# Altium schematic sheet 04_CONNECTOR_OUT_2.SchDoc
size 420 x 297 mm; SheetNumber: 6; SheetTotal: 29
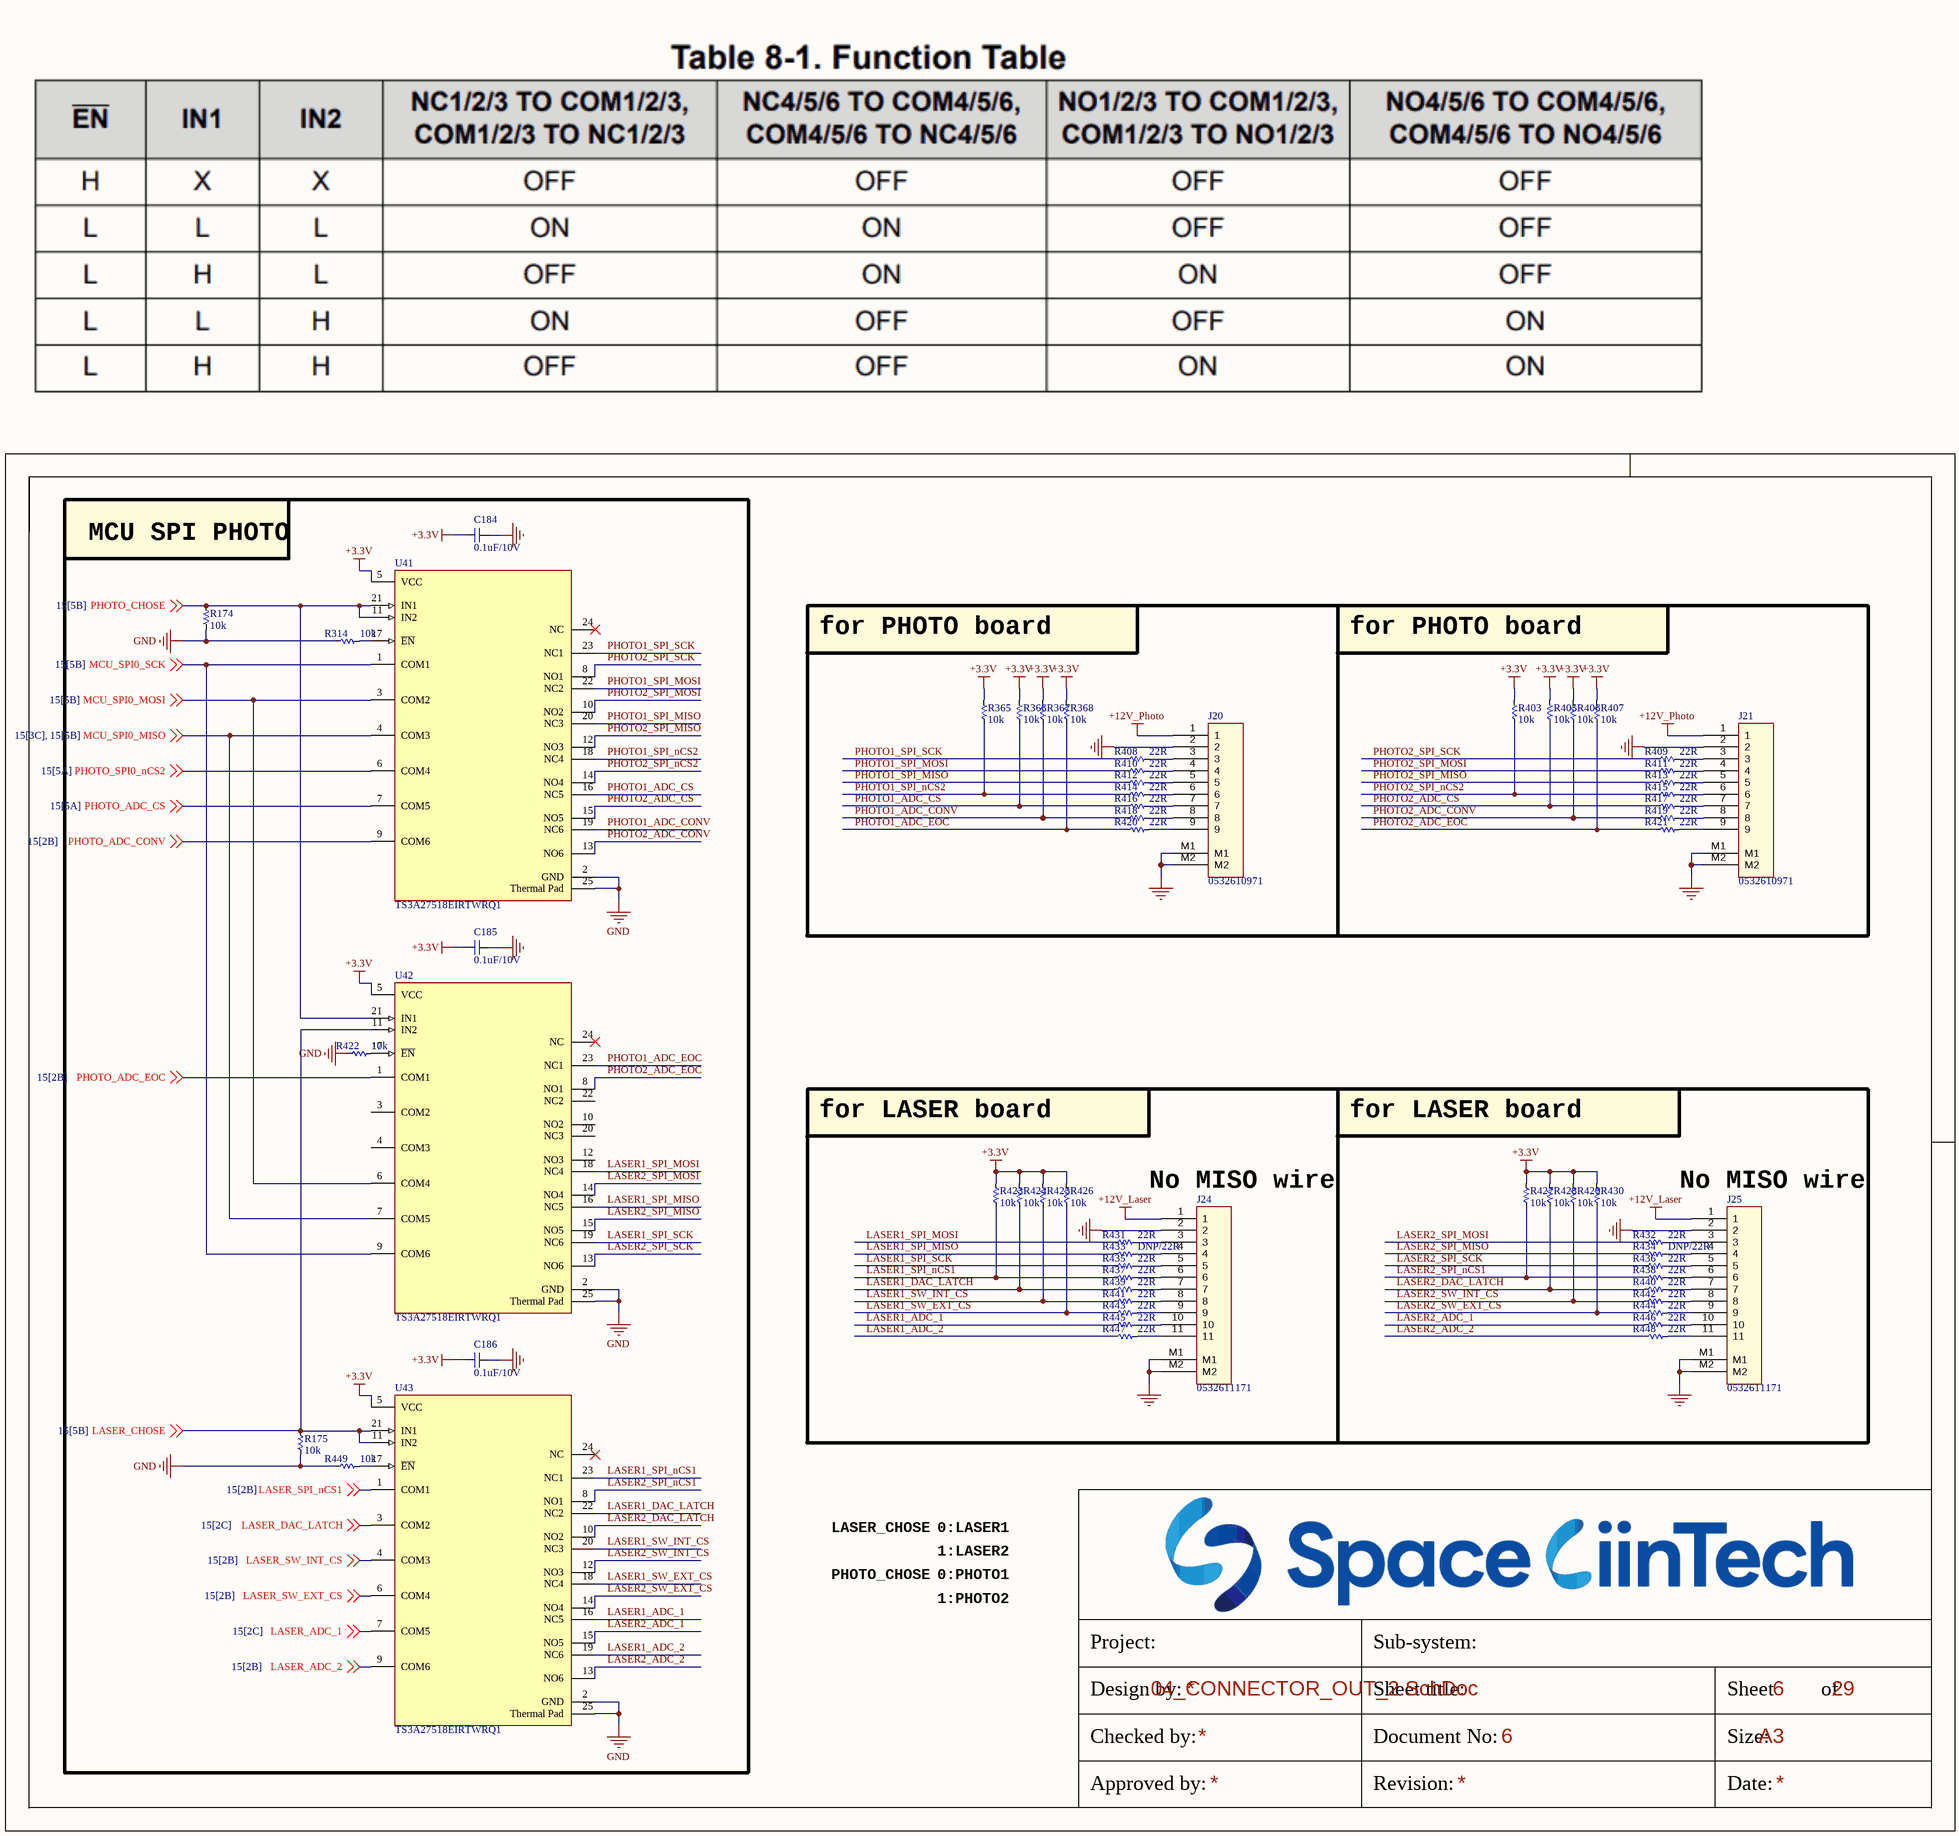
[diagram p0: 04_CONNECTOR_OUT_2.SchDoc]

## Parts
C184  0.1uF/10V  [CAP_C_1005X60]
C185  0.1uF/10V  [CAP_C_1005X60]
C186  0.1uF/10V  [CAP_C_1005X60]
J20  0532610971  [MOLEX_0532610971]
J21  0532610971  [MOLEX_0532610971]
J24  0532611171  [MOLEX_0532611171]
J25  0532611171  [MOLEX_0532611171]
R174  10k  [RES_C_1005X40]
R175  10k  [RES_C_1005X40]
R314  10k  [RES_C_1005X40]
R365  10k  [RES_C_1005X40]
R366  10k  [RES_C_1005X40]
R367  10k  [RES_C_1005X40]
R368  10k  [RES_C_1005X40]
R403  10k  [RES_C_1005X40]
R405  10k  [RES_C_1005X40]
R406  10k  [RES_C_1005X40]
R407  10k  [RES_C_1005X40]
R408  22R  [RES_C_1005X40]
R409  22R  [RES_C_1005X40]
R410  22R  [RES_C_1005X40]
R411  22R  [RES_C_1005X40]
R412  22R  [RES_C_1005X40]
R413  22R  [RES_C_1005X40]
R414  22R  [RES_C_1005X40]
R415  22R  [RES_C_1005X40]
R416  22R  [RES_C_1005X40]
R417  22R  [RES_C_1005X40]
R418  22R  [RES_C_1005X40]
R419  22R  [RES_C_1005X40]
R420  22R  [RES_C_1005X40]
R421  22R  [RES_C_1005X40]
R422  10k  [RES_C_1005X40]
R423  10k  [RES_C_1005X40]
R424  10k  [RES_C_1005X40]
R425  10k  [RES_C_1005X40]
R426  10k  [RES_C_1005X40]
R427  10k  [RES_C_1005X40]
R428  10k  [RES_C_1005X40]
R429  10k  [RES_C_1005X40]
R430  10k  [RES_C_1005X40]
R431  22R  [RES_C_1005X40]
R432  22R  [RES_C_1005X40]
R433  DNP/22R  [RES_C_1005X40]
R434  DNP/22R  [RES_C_1005X40]
R435  22R  [RES_C_1005X40]
R436  22R  [RES_C_1005X40]
R437  22R  [RES_C_1005X40]
R438  22R  [RES_C_1005X40]
R439  22R  [RES_C_1005X40]
R440  22R  [RES_C_1005X40]
R441  22R  [RES_C_1005X40]
R442  22R  [RES_C_1005X40]
R443  22R  [RES_C_1005X40]
R444  22R  [RES_C_1005X40]
R445  22R  [RES_C_1005X40]
R446  22R  [RES_C_1005X40]
R447  22R  [RES_C_1005X40]
R448  22R  [RES_C_1005X40]
R449  10k  [RES_C_1005X40]
U41  TS3A27518EIRTWRQ1  [FP-RTW0024B-IPC_A]
U42  TS3A27518EIRTWRQ1  [FP-RTW0024B-IPC_A]
U43  TS3A27518EIRTWRQ1  [FP-RTW0024B-IPC_A]

## Blocks framed on the sheet
MCU SPI PHOTO: C184-C186 R174 R175 R314 R422 R449 U41-U43
for PHOTO board: J20 R365-R368 R408 R410 R412 R414 R416 R418 R420
for PHOTO board: J21 R403 R405-R407 R409 R411 R413 R415 R417 R419 R421

## Nets
+3.3V: C184.2 C185.2 C186.2 R365.1 R366.1 R367.1 R368.1 R403.1 R405.1 R406.1 R407.1 R423.1 R424.1 R425.1 R426.1 R427.1 R428.1 R429.1 R430.1 U41.5(VCC) U42.5(VCC) U43.5(VCC)
+12V_Laser: J24.1 J25.1
+12V_Photo: J20.1 J21.1
GND: C184.1 C185.1 C186.1 J20.2 J20.M1 J20.M2 J21.2 J21.M1 J21.M2 J24.2 J24.M1 J24.M2 J25.2 J25.M1 J25.M2 R174.1 R175.1 R314.1 R422.1 R449.1 U41.2(GND) U41.25(Thermal_Pad) U42.2(GND) U42.25(Thermal_Pad) U43.2(GND) U43.25(Thermal_Pad)
LASER1_ADC_1: R445.1 U43.16(NC5)
LASER1_ADC_2: R447.1 U43.19(NC6)
LASER1_DAC_LATCH: R424.2 R439.1 U43.22(NC2)
LASER1_SPI_MISO: R433.1 U42.16(NC5)
LASER1_SPI_MOSI: R431.1 U42.18(NC4)
LASER1_SPI_nCS1: R423.2 R437.1 U43.23(NC1)
LASER1_SPI_SCK: R435.1 U42.19(NC6)
LASER1_SW_EXT_CS: R426.2 R443.1 U43.18(NC4)
LASER1_SW_INT_CS: R425.2 R441.1 U43.20(NC3)
LASER2_ADC_1: R446.1 U43.15(NO5)
LASER2_ADC_2: R448.1 U43.13(NO6)
LASER2_DAC_LATCH: R428.2 R440.1 U43.10(NO2)
LASER2_SPI_MISO: R434.1 U42.15(NO5)
LASER2_SPI_MOSI: R432.1 U42.14(NO4)
LASER2_SPI_nCS1: R427.2 R438.1 U43.8(NO1)
LASER2_SPI_SCK: R436.1 U42.13(NO6)
LASER2_SW_EXT_CS: R430.2 R444.1 U43.14(NO4)
LASER2_SW_INT_CS: R429.2 R442.1 U43.12(NO3)
LASER_ADC_1: U43.7(COM5) ; off-sheet LASER_ADC_1
LASER_ADC_2: U43.9(COM6) ; off-sheet LASER_ADC_2
LASER_CHOSE: R175.2 U42.11(IN2) U43.11(IN2) U43.21(IN1) ; off-sheet LASER_CHOSE
LASER_DAC_LATCH: U43.3(COM2) ; off-sheet LASER_DAC_LATCH
LASER_SPI_nCS1: U43.1(COM1) ; off-sheet LASER_SPI_nCS1
LASER_SW_EXT_CS: U43.6(COM4) ; off-sheet LASER_SW_EXT_CS
LASER_SW_INT_CS: U43.4(COM3) ; off-sheet LASER_SW_INT_CS
MCU_SPI0_MISO: U41.4(COM3) U42.7(COM5) ; off-sheet MCU_SPI0_MISO
MCU_SPI0_MOSI: U41.3(COM2) U42.6(COM4) ; off-sheet MCU_SPI0_MOSI
MCU_SPI0_SCK: U41.1(COM1) U42.9(COM6) ; off-sheet MCU_SPI0_SCK
PHOTO1_ADC_CONV: R367.2 R418.1 U41.19(NC6)
PHOTO1_ADC_CS: R366.2 R416.1 U41.16(NC5)
PHOTO1_ADC_EOC: R368.2 R420.1 U42.23(NC1)
PHOTO1_SPI_MISO: R412.1 U41.20(NC3)
PHOTO1_SPI_MOSI: R410.1 U41.22(NC2)
PHOTO1_SPI_nCS2: R365.2 R414.1 U41.18(NC4)
PHOTO1_SPI_SCK: R408.1 U41.23(NC1)
PHOTO2_ADC_CONV: R406.2 R419.1 U41.13(NO6)
PHOTO2_ADC_CS: R405.2 R417.1 U41.15(NO5)
PHOTO2_ADC_EOC: R407.2 R421.1 U42.8(NO1)
PHOTO2_SPI_MISO: R413.1 U41.12(NO3)
PHOTO2_SPI_MOSI: R411.1 U41.10(NO2)
PHOTO2_SPI_nCS2: R403.2 R415.1 U41.14(NO4)
PHOTO2_SPI_SCK: R409.1 U41.8(NO1)
PHOTO_ADC_CONV: U41.9(COM6) ; off-sheet PHOTO_ADC_CONV
PHOTO_ADC_CS: U41.7(COM5) ; off-sheet PHOTO_ADC_CS
PHOTO_ADC_EOC: U42.1(COM1) ; off-sheet PHOTO_ADC_EOC
PHOTO_CHOSE: R174.2 U41.11(IN2) U41.21(IN1) U42.21(IN1) ; off-sheet PHOTO_CHOSE
PHOTO_SPI0_nCS2: U41.6(COM4) ; off-sheet PHOTO_SPI0_nCS2
NetJ20_3: J20.3 R408.2
NetJ20_4: J20.4 R410.2
NetJ20_5: J20.5 R412.2
NetJ20_6: J20.6 R414.2
NetJ20_7: J20.7 R416.2
NetJ20_8: J20.8 R418.2
NetJ20_9: J20.9 R420.2
NetJ21_3: J21.3 R409.2
NetJ21_4: J21.4 R411.2
NetJ21_5: J21.5 R413.2
NetJ21_6: J21.6 R415.2
NetJ21_7: J21.7 R417.2
NetJ21_8: J21.8 R419.2
NetJ21_9: J21.9 R421.2
NetJ24_3: J24.3 R431.2
NetJ24_4: J24.4 R433.2
NetJ24_5: J24.5 R435.2
NetJ24_6: J24.6 R437.2
NetJ24_7: J24.7 R439.2
NetJ24_8: J24.8 R441.2
NetJ24_9: J24.9 R443.2
NetJ24_10: J24.10 R445.2
NetJ24_11: J24.11 R447.2
NetJ25_3: J25.3 R432.2
NetJ25_4: J25.4 R434.2
NetJ25_5: J25.5 R436.2
NetJ25_6: J25.6 R438.2
NetJ25_7: J25.7 R440.2
NetJ25_8: J25.8 R442.2
NetJ25_9: J25.9 R444.2
NetJ25_10: J25.10 R446.2
NetJ25_11: J25.11 R448.2
NetR314_2: R314.2 U41.17(~{EN})
NetR422_2: R422.2 U42.17(~{EN})
NetR449_2: R449.2 U43.17(~{EN})

Not connected (* = marked no-connect by the designer): U41 24(NC)*; U42 3(COM2) 4(COM3) 10(NO2) 12(NO3) 20(NC3) 22(NC2) 24(NC)*; U43 24(NC)*

## Notes on the sheet
- for LASER board
- (near J24) No MISO wire
- (near J25) No MISO wire
- LASER_CHOSE
- 0:LASER1
- 1:LASER2
- PHOTO_CHOSE
- 0:PHOTO1
- 1:PHOTO2
- Project:
- Sub-system:
- Design by:
- Sheet title:
- Sheet
- of
- Checked by:
- Approved by:
- Revision:
- Document No:
- Size:
- Date:
- A3

## Library data of the parts
C184-C186 = _CAP_C_2: CAP CHIP
J20 J21 = Header 9x1_2M
J24 J25 = Header 11x1_2M
R174 R175 R314 R365-R368 R403 R405-R449 = _RES_B_2: RES
U41-U43 = CMP-04892-000110-1: IC MUX/DEMUX 1X2 24WQFN; Supply Type: Single; Max Supply Voltage: 3.6V; Number of Circuits: 6; On-State Resistance: 6.2R; Turn-Off Delay Time: 70ns; -3db Bandwidth: 240MHz; Operating Supply Current: 40nA; Min Supply Voltage: 1.65V; Logic Function: Multiplexer; Turn-On Delay Time: 68ns; Min Operating Temperature: -40°C; Packaging: Tape and Reel; Case/Package: QFN; Package Quantity: 1; RoHS Compliant: Yes; Lead Free: Lead Free; Bandwidth: 240MHz; Max Operating Temperature: 105°C; Number of Channels: 6; Series: Automotive, AEC-Q100; Number of Pins: 24; Mount: Surface Mount